# Altium schematic sheet bat_connectors.SchDoc
size A3; DocumentNumber: 17; SheetNumber: 17; SheetTotal: 19; SheetDescription: Connection to pack
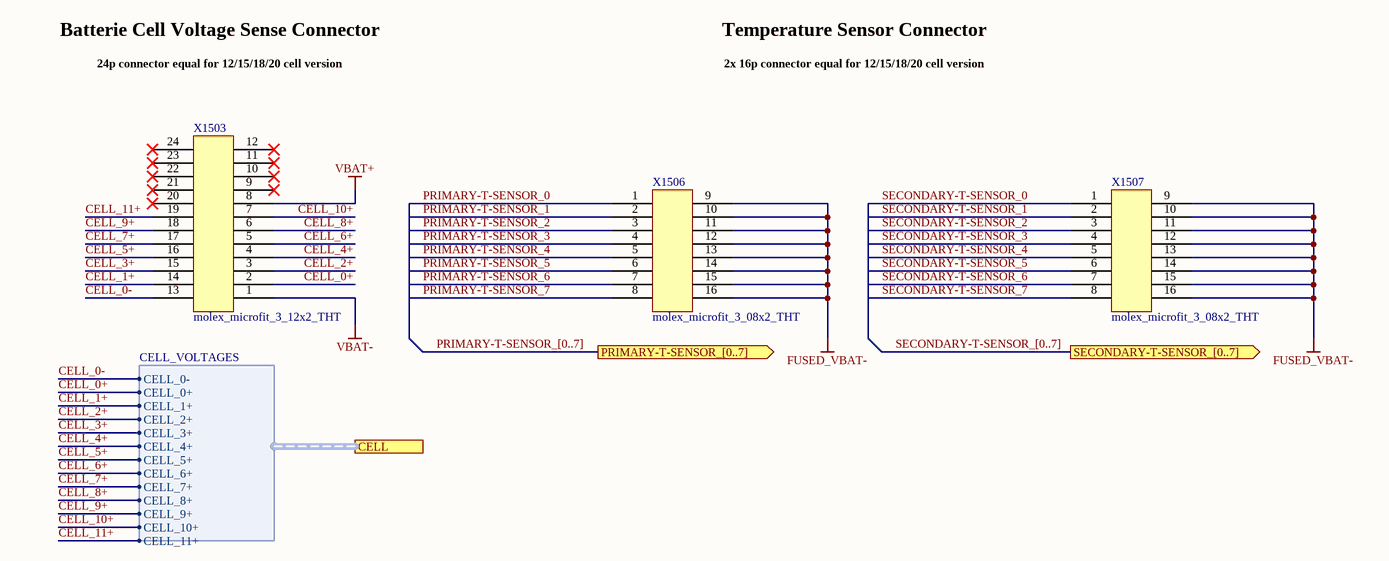
[diagram p0: bat_connectors.SchDoc]

## Parts
X1503  molex_microfit_3_12x2_THT  [MOLEX_MICROFIT_12x2_THT]
X1506  molex_microfit_3_08x2_THT  [MOLEX_MICROFIT_08x2_THT]
X1507  molex_microfit_3_08x2_THT  [MOLEX_MICROFIT_08x2_THT]

## Ports
CELL (harness CELL_VOLTAGES), PRIMARY-T-SENSOR_[0..7] (out), SECONDARY-T-SENSOR_[0..7] (out)

## Harnesses
CELL_VOLTAGES: CELL_0-, CELL_0+, CELL_1+, CELL_2+, CELL_3+, CELL_4+, CELL_5+, CELL_6+, CELL_7+, CELL_8+, CELL_9+, CELL_10+, CELL_11+

## Nets
FUSED_VBAT-: X1506.9 X1506.10 X1506.11 X1506.12 X1506.13 X1506.14 X1506.15 X1506.16 X1507.9 X1507.10 X1507.11 X1507.12 X1507.13 X1507.14 X1507.15 X1507.16
VBAT+: X1503.8
VBAT-: X1503.1
CELL_0+: X1503.2 ; port CELL.CELL_0+
CELL_0-: X1503.13 ; port CELL.CELL_0-
CELL_1+: X1503.14 ; port CELL.CELL_1+
CELL_2+: X1503.3 ; port CELL.CELL_2+
CELL_3+: X1503.15 ; port CELL.CELL_3+
CELL_4+: X1503.4 ; port CELL.CELL_4+
CELL_5+: X1503.16 ; port CELL.CELL_5+
CELL_6+: X1503.5 ; port CELL.CELL_6+
CELL_7+: X1503.17 ; port CELL.CELL_7+
CELL_8+: X1503.6 ; port CELL.CELL_8+
CELL_9+: X1503.18 ; port CELL.CELL_9+
CELL_10+: X1503.7 ; port CELL.CELL_10+
CELL_11+: X1503.19 ; port CELL.CELL_11+
PRIMARY-T-SENSOR_0: X1506.1
PRIMARY-T-SENSOR_1: X1506.2
PRIMARY-T-SENSOR_2: X1506.3
PRIMARY-T-SENSOR_3: X1506.4
PRIMARY-T-SENSOR_4: X1506.5
PRIMARY-T-SENSOR_5: X1506.6
PRIMARY-T-SENSOR_6: X1506.7
PRIMARY-T-SENSOR_7: X1506.8
SECONDARY-T-SENSOR_0: X1507.1
SECONDARY-T-SENSOR_1: X1507.2
SECONDARY-T-SENSOR_2: X1507.3
SECONDARY-T-SENSOR_3: X1507.4
SECONDARY-T-SENSOR_4: X1507.5
SECONDARY-T-SENSOR_5: X1507.6
SECONDARY-T-SENSOR_6: X1507.7
SECONDARY-T-SENSOR_7: X1507.8

Not connected (* = marked no-connect by the designer): X1503 9* 10* 11* 12* 20* 21* 22* 23* 24*

## Buses and harness runs
bus PRIMARY-T-SENSOR_[0..7] = port PRIMARY-T-SENSOR_[0..7]
bus SECONDARY-T-SENSOR_[0..7] = port SECONDARY-T-SENSOR_[0..7]

## Notes on the sheet
- Batterie Cell Voltage Sense Connector
- 24p connector equal for 12/15/18/20 cell version
- Temperature Sensor Connector
- 2x 16p connector equal for 12/15/18/20 cell version
- Fraunhofer IISB
- Schottkystr. 10
- developed by:
- 91058 Erlangen
- Germany
- Author
- Project
- License
- Description
- File
- Version
- Release Date
- Sheet
- www.foxbms.org
- www.iisb.fraunhofer.de
- foxBMS Team
- /

## Library data of the parts
X1503 = molex_microfit_3_12x2_THT: Micro-Fit 3.0 Right Angle Header, 3.00mm Pitch, Dual Row, 24 Circuits, with Snap-in Plastic Peg PCB Lock, Tin, Glow Wire Capable, Black, 43045-2400; Manufacturer: Molex; Circuits: 24; Rated Voltage: 600V; Rated Current: 8.5A; Automotive Qualified: False; Part Number: molex_microfit_3_12x2_THT; Part Name: MicroFit; Operating Temperature: -40°C - +105°C; Supplier 1: Farnell; Supplier Part Number 1: 1012245
X1506 X1507 = molex_microfit_3_08x2_THT: Micro-Fit 3.0 Right Angle Header, 3.00mm Pitch, Dual Row, 16 Circuits, with Snap-in Plastic Peg PCB Lock, Tin, Glow Wire Capable, Black, 43045-1600; Manufacturer: Molex; Circuits: 16; Rated Voltage: 600V; Rated Current: 8.5A; Automotive Qualified: False; Part Number: molex_microfit_3_08x2_THT; Part Name: MicroFit; Operating Temperature: -40°C - +105°C; Supplier 1: Farnell; Supplier Part Number 1: 9961380